# Altium schematic sheet Connector.SchDoc
size A4; SheetNumber: 3; SheetTotal: 3
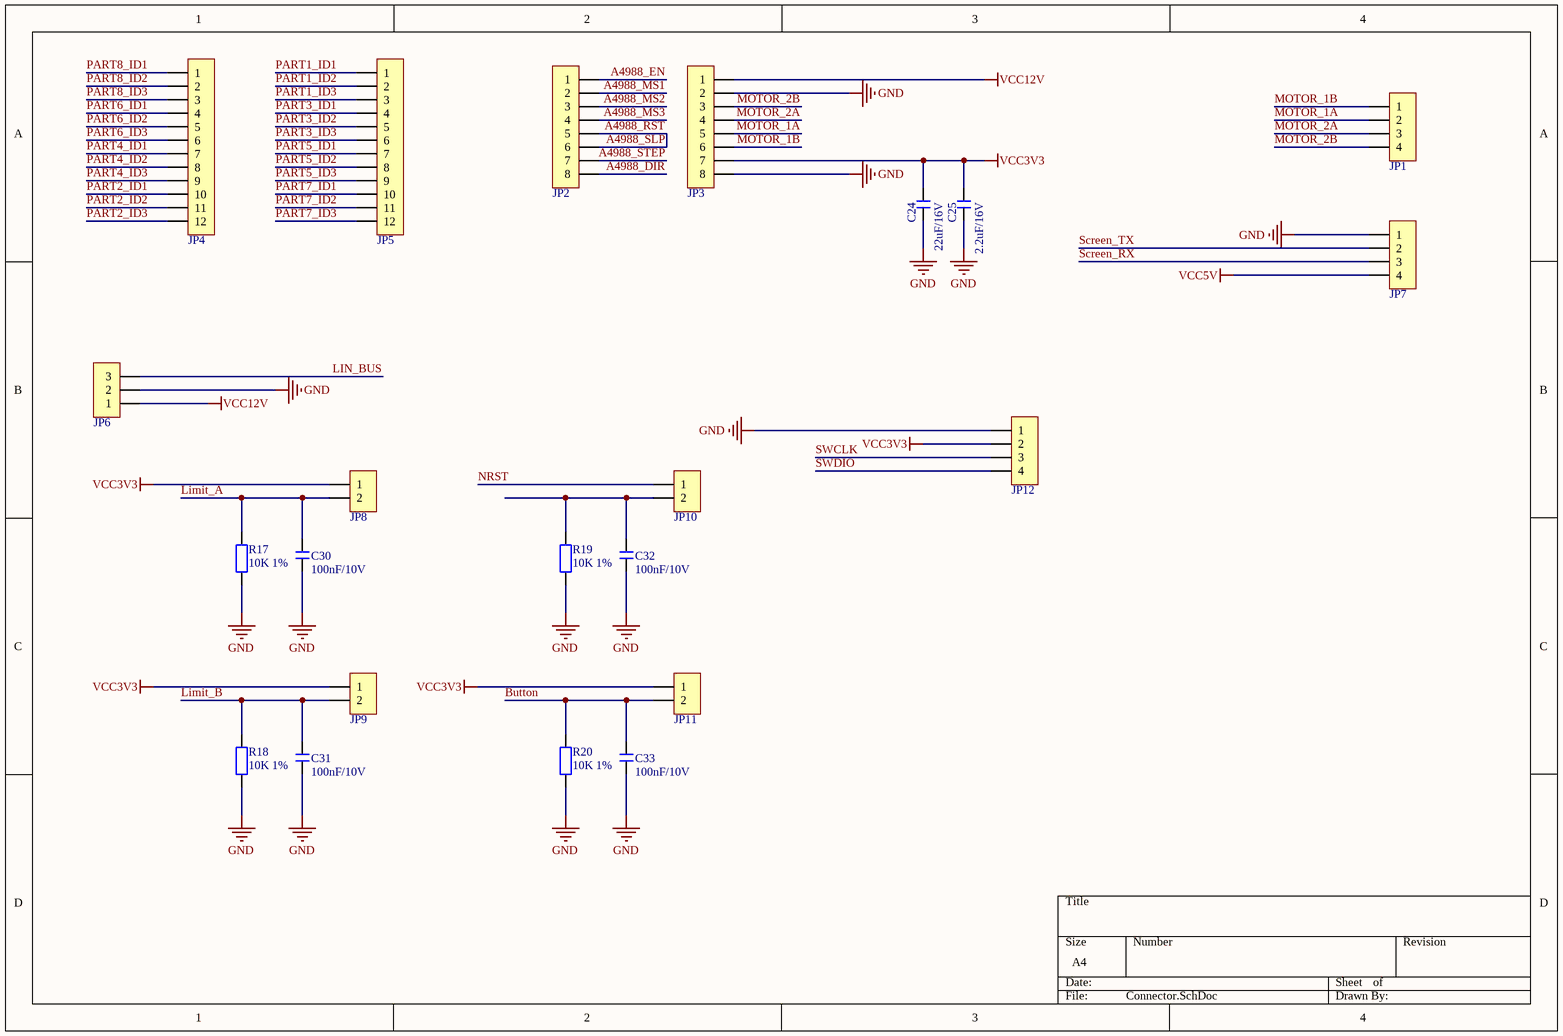
[diagram p0: Connector.SchDoc]

## Parts
C24  22uF/16V  [C0603_L]
C25  2.2uF/16V  [C0603_L]
C30  100nF/10V  [C0603_L]
C31  100nF/10V  [C0603_L]
C32  100nF/10V  [C0603_L]
C33  100nF/10V  [C0603_L]
JP1  HDR-1X4  [XH2.54-LI-4P]  (value not drawn)
JP2  HDR-1X8  [HDR2.54-M-LI-8P]  (value not drawn)
JP3  HDR-1X8  [HDR2.54-M-LI-8P]  (value not drawn)
JP4  HDR-1X12  [MX1.25-L-12P]  (value not drawn)
JP5  HDR-1X12  [MX1.25-L-12P]  (value not drawn)
JP6  HDR-1X3  [XH2.54-LI-3P]  (value not drawn)
JP7  HDR-1X4  [XH2.54-LI-4P]  (value not drawn)
JP8  HDR-1X2  [XH2.54-LI-2P]  (value not drawn)
JP9  HDR-1X2  [XH2.54-LI-2P]  (value not drawn)
JP10  HDR-1X2  [XH2.54-LI-2P]  (value not drawn)
JP11  HDR-1X2  [XH2.54-LI-2P]  (value not drawn)
JP12  HDR-1X4  [HDR2.54-LI-4P]  (value not drawn)
R17  10K 1%  [R0603_L]
R18  10K 1%  [R0603_L]
R19  10K 1%  [R0603_L]
R20  10K 1%  [R0603_L]

## Nets
GND: C24.1 C25.1 C30.2 C31.2 C32.2 C33.2 JP3.2 JP3.8 JP6.2 JP7.1 JP12.1 R17.2 R18.2 R19.2 R20.2
VCC3V3: C24.2 C25.2 JP3.7 JP8.1 JP9.1 JP11.1 JP12.2
VCC5V: JP7.4
VCC12V: JP3.1 JP6.1
A4988_DIR: JP2.8
A4988_EN: JP2.1
A4988_MS1: JP2.2
A4988_MS2: JP2.3
A4988_MS3: JP2.4
A4988_RST: JP2.5 JP2.6  [also labelled A4988_SLP]
A4988_STEP: JP2.7
Button: C33.1 JP11.2 R20.1
Limit_A: C30.1 JP8.2 R17.1
Limit_B: C31.1 JP9.2 R18.1
LIN_BUS: JP6.3
MOTOR_1A: JP1.2 JP3.5
MOTOR_1B: JP1.1 JP3.6
MOTOR_2A: JP1.3 JP3.4
MOTOR_2B: JP1.4 JP3.3
NRST: JP10.1
PART1_ID1: JP5.1
PART1_ID2: JP5.2
PART1_ID3: JP5.3
PART2_ID1: JP4.10
PART2_ID2: JP4.11
PART2_ID3: JP4.12
PART3_ID1: JP5.4
PART3_ID2: JP5.5
PART3_ID3: JP5.6
PART4_ID1: JP4.7
PART4_ID2: JP4.8
PART4_ID3: JP4.9
PART5_ID1: JP5.7
PART5_ID2: JP5.8
PART5_ID3: JP5.9
PART6_ID1: JP4.4
PART6_ID2: JP4.5
PART6_ID3: JP4.6
PART7_ID1: JP5.10
PART7_ID2: JP5.11
PART7_ID3: JP5.12
PART8_ID1: JP4.1
PART8_ID2: JP4.2
PART8_ID3: JP4.3
Screen_RX: JP7.3
Screen_TX: JP7.2
SWCLK: JP12.3
SWDIO: JP12.4
NetC32_1: C32.1 JP10.2 R19.1

## Library data of the parts
C24 C25 C30-C33 = C: 无极性贴片电容; 版权归属: 源创客; 材质: X7R; BOM名称: 无极性贴片电容; 学习资源: www.ooocke.com
JP1 JP7 JP12 = Header 4: 4P接插件; 版权归属: 源创客; BOM名称: 4P接插件; 学习资源: www.ooocke.com
JP2 JP3 = Header 8: 8P接插件; 版权归属: 源创客; BOM名称: 8P接插件; 学习资源: www.ooocke.com
JP4 JP5 = Header 12: 12P接插件; 版权归属: 源创客; BOM名称: 12P接插件; 学习资源: www.ooocke.com
JP6 = Header 3: 3P接插件; 版权归属: 源创客; BOM名称: 3P接插件; 学习资源: www.ooocke.com
JP8-JP11 = Header 2: 2P接插件; 版权归属: 源创客; BOM名称: 2P接插件; 学习资源: www.ooocke.com
R17-R20 = R: 贴片电阻; 版权归属: 源创客; BOM名称: 贴片电阻; 学习资源: www.ooocke.com